# Altium schematic sheet EMG_Sensors_Control.SchDoc
size 431 x 279 mm; SheetNumber: 1; SheetTotal: 1; ENG_APP_DATE: --/--/--; DSN_APP_DATE: --/--/--; CHK_APP_DATE: --/--/--
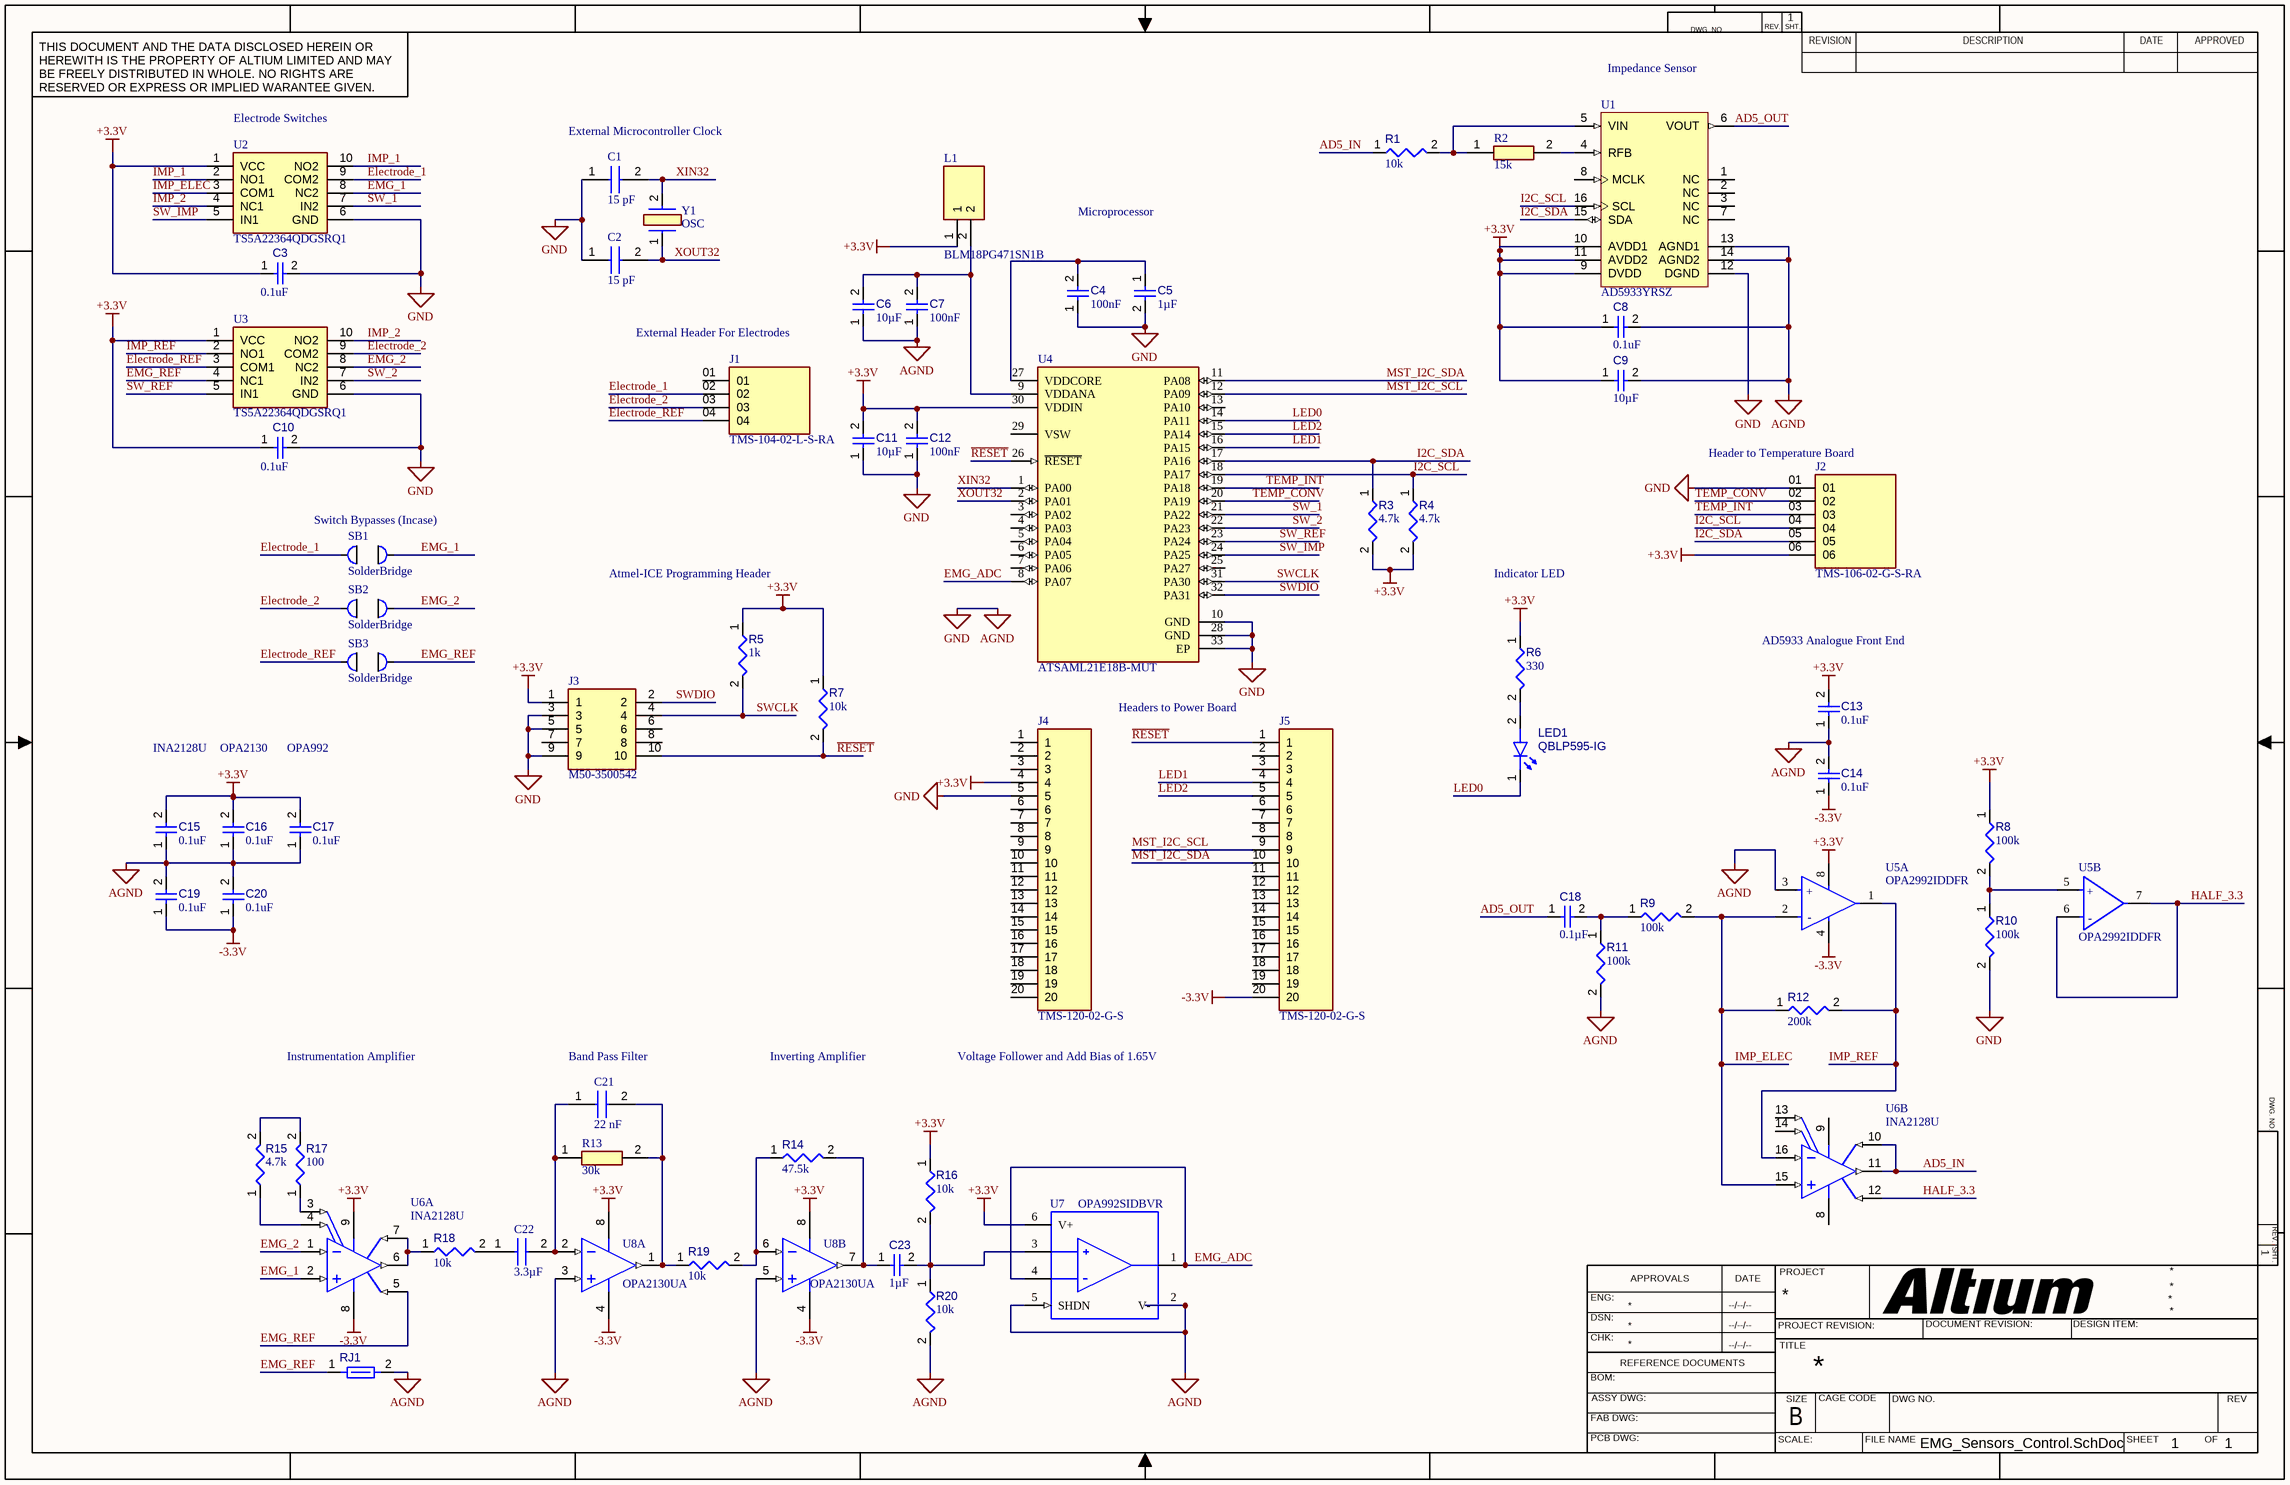
[diagram p0: EMG_Sensors_Control.SchDoc]

## Parts
C1  15 pF  [CAPC1005X55N]
C2  15 pF  [CAPC1005X55N]
C3  value 0.1uF  [CAPC1005X56X25LL10T15]  (hidden comment: Capacitor 0.1 uF +/- 5% 16 V 0402)
C4  value 100nF  [CAPC1005X56X25LL10T15]  (hidden comment: Capacitor 0.1 uF +/- 5% 16 V 0402)
C5  value 1µF  [CAPC1608X90X35ML15T15]  (hidden comment: Capacitor 1uF +/- 10% 16V 0603)
C6  value 10µF  [CAPC2013X135X45NL10T25]  (hidden comment: Capacitor 10 uF +/- 10% 16 V 0805)
C7  value 100nF  [CAPC1005X56X25LL10T15]  (hidden comment: Capacitor 0.1 uF +/- 5% 16 V 0402)
C8  value 0.1uF  [CAPC1005X56X25LL10T15]  (hidden comment: Capacitor 0.1 uF +/- 5% 16 V 0402)
C9  value 10µF  [CAPC0603(1608)100_L]  (hidden comment: Capacitor 10µF +/-20% 10V 0603)
C10  value 0.1uF  [CAPC1005X56X25LL10T15]  (hidden comment: Capacitor 0.1 uF +/- 5% 16 V 0402)
C11  value 10µF  [CAPC2013X135X45NL10T25]  (hidden comment: Capacitor 10 uF +/- 10% 16 V 0805)
C12  value 100nF  [CAPC1005X56X25LL10T15]  (hidden comment: Capacitor 0.1 uF +/- 5% 16 V 0402)
C13  value 0.1uF  [CAPC1005X56X25LL10T15]  (hidden comment: Capacitor 0.1 uF +/- 5% 16 V 0402)
C14  value 0.1uF  [CAPC1005X56X25LL10T15]  (hidden comment: Capacitor 0.1 uF +/- 5% 16 V 0402)
C15  value 0.1uF  [CAPC1005X56X25LL10T15]  (hidden comment: Capacitor 0.1 uF +/- 5% 16 V 0402)
C16  value 0.1uF  [CAPC1005X56X25LL10T15]  (hidden comment: Capacitor 0.1 uF +/- 5% 16 V 0402)
C17  value 0.1uF  [CAPC1005X56X25LL10T15]  (hidden comment: Capacitor 0.1 uF +/- 5% 16 V 0402)
C18  value 0.1µF  [CAPC1005X55X25LL05T10]  (hidden comment: Capacitor 1 uF +/- 10% 6.3 V 0402)
C19  value 0.1uF  [CAPC1005X56X25LL10T15]  (hidden comment: Capacitor 0.1 uF +/- 5% 16 V 0402)
C20  value 0.1uF  [CAPC1005X56X25LL10T15]  (hidden comment: Capacitor 0.1 uF +/- 5% 16 V 0402)
C21  22 nF  [CAPC1005X55N]
C22  3.3µF  [C1005_Commercial]
C23  value 1µF  [CAPC1005X55X25LL05T10]  (hidden comment: Capacitor 1 uF +/- 10% 6.3 V 0402)
J1  TMS-104-02-L-S-RA  [SAMTEC_TMS-104-02-L-S-RA]
J2  TMS-106-02-G-S-RA  [SAMTEC_TMS-106-02-G-S-RA]
J3  M50-3500542  [M503500542]
J4  TMS-120-02-G-S  [TMS-120-YY-XX-S]
J5  TMS-120-02-G-S  [TMS-120-YY-XX-S]
L1  BLM18PG471SN1B  [BLM18AG102BH1D]
LED1  QBLP595-IG  [QTB-QBLP595_V]
R1  value 10k  [RESC1005X40X25ML05T05]  (hidden comment: Resistor 10k +/-1% 0402 63 mW)
R2  15k  [H2C/H2R]
R3  value 4.7k  [RESC1005X40X25ML05T05]  (hidden comment: Resistor 4k7 +/-1% 0402 100 mW)
R4  value 4.7k  [RESC1005X40X25ML05T05]  (hidden comment: Resistor 4k7 +/-1% 0402 100 mW)
R5  value 1k  [RESC1005X40X25ML05T05]  (hidden comment: Resistor 1k +/-1% 0402 63 mW)
R6  value 330  [RESC0402(1005)_L]  (hidden comment: Resistor 330R +/-5 % 0402 63 mW)
R7  value 10k  [RESC1005X40X25ML05T05]  (hidden comment: Resistor 10k +/-1% 0402 63 mW)
R8  value 100k  [RESC1005X40X25ML05T05]  (hidden comment: Resistor 100k +/-1% 0402 63 mW)
R9  value 100k  [RESC1005X40X25ML05T05]  (hidden comment: Resistor 100k +/-1% 0402 63 mW)
R10  value 100k  [RESC1005X40X25ML05T05]  (hidden comment: Resistor 100k +/-1% 0402 63 mW)
R11  value 100k  [RESC1005X40X25ML05T05]  (hidden comment: Resistor 1k +/-1% 0402 63 mW)
R12  value 200k  [RESC0402(1005)_L]  (hidden comment: Resistor 1M +/-1 % 0402 63 mW)
R13  30k  [RESC1005X40N]
R14  value 47.5k  [RESC0402(1005)_L]  (hidden comment: Resistor 47K5 +/-1 % 0402 63 mW)
R15  value 4.7k  [RESC1005X40X25ML05T05]  (hidden comment: Resistor 4k7 +/-1% 0402 100 mW)
R16  value 10k  [RESC1005X40X25ML05T05]  (hidden comment: Resistor 10k +/-1% 0402 63 mW)
R17  value 100  [RESC0402(1005)_L]  (hidden comment: 100R2F)
R18  value 10k  [RESC1005X40X25ML05T05]  (hidden comment: Resistor 10k +/-1% 0402 63 mW)
R19  value 10k  [RESC1005X40X25ML05T05]  (hidden comment: Resistor 10k +/-1% 0402 63 mW)
R20  value 10k  [RESC1005X40X25ML05T05]  (hidden comment: Resistor 10k +/-1% 0402 63 mW)
RJ1  Net Tie 10x8mil  [New footprint 1]  (value not drawn)  (net tie, no BOM)
SB1  SolderBridge  [SolderBridge-Footprint-1]
SB2  SolderBridge  [SolderBridge-Footprint-1]
SB3  SolderBridge  [SolderBridge-Footprint-1]
U1  AD5933YRSZ  [ADI-RS-16_L]
U2  TS5A22364QDGSRQ1  [SOP50P490X110-10N]
U3  TS5A22364QDGSRQ1  [SOP50P490X110-10N]
U4  ATSAML21E18B-MUT  [FP-PG-IPC_B]
U5  OPA2992IDDFR  [FP-DDF0008A-MFG]  (parts A,B of 2)
U6  INA2128U  [DW0016A_N]  (parts A,B of 2)
U7  OPA992SIDBVR  [FP-DBV0006A-MFG]
U8  OPA2130UA  [D0008A_N]  (parts A,B of 2)
Y1  OSC  [ABS0716632768KHZT]

## Nets
+3.3V: C3.1 C8.1 C9.1 C10.1 C11.2 C12.2 C13.2 C15.2 C16.2 C17.2 J2.06 J3.1 J4.4 L1.1 R3.2 R4.2 R5.1 R6.1 R7.1 R8.1 R16.1 U1.9(DVDD) U1.10(AVDD1) U1.11(AVDD2) U2.1(VCC) U3.1(VCC) U4.30(VDDIN) U5.8(V+) U6.9(V+) U7.6(V+) U8.8(V+)
-3.3V: C14.1 C19.1 C20.1 J5.20 U5.4(V-) U6.8(V-) U8.4(V-)
AGND: C1.1 C2.1 C3.2 C4.1 C5.2 C6.1 C7.1 C8.2 C9.2 C10.2 C11.1 C12.1 C13.1 C14.2 C15.1 C16.1 C17.1 C19.2 C20.2 J2.01 J3.3 J3.5 J3.9 J4.5 R10.2 R11.2 R20.2 RJ1.2 U1.12(DGND) U1.13(AGND1) U1.14(AGND2) U2.6(GND) U3.6(GND) U4.10(GND) U4.28(GND) U4.33(EP) U5.3(IN1+) U7.2(V-) U7.5(SHDN) U8.3(IN_A+) U8.5(IN_B+)  [also labelled GND]
~{RESET}: J3.10 J5.1 R7.2 U4.26(~{RESET})
AD5_IN: R1.1 U6.10(SENSEB) U6.11(VOB)
AD5_OUT: C18.1 U1.6(VOUT)
Electrode_1: J1.02 SB1.2 U2.9(COM2)
Electrode_2: J1.03 SB2.2 U3.9(COM2)
Electrode_REF: J1.04 SB3.2 U3.3(COM1)
EMG_1: SB1.1 U2.8(NC2) U6.2(VINA+)
EMG_2: SB2.1 U3.8(NC2) U6.1(VINA-)
EMG_ADC: U4.8(PA07) U7.1(OUT) U7.4(-IN)
EMG_REF: RJ1.1 SB3.1 U3.4(NC1) U6.5(REFA)
HALF_3.3: U5.6(IN2-) U5.7(OUT2) U6.12(REFB)
I2C_SCL: J2.04 R4.1 U1.16(SCL) U4.18(PA17)
I2C_SDA: J2.05 R3.1 U1.15(SDA) U4.17(PA16)
IMP_1: U2.2(NO1) U2.10(NO2)
IMP_2: U2.4(NC1) U3.10(NO2)
IMP_ELEC: R9.2 R12.1 U2.3(COM1) U5.2(IN1-) U6.15(VINB+)
IMP_REF: R12.2 U3.2(NO1) U5.1(OUT1) U6.16(VINB-)
LED0: LED1.1(K) U4.14(PA11)
LED1: J5.4 U4.16(PA15)
LED2: J5.5 U4.15(PA14)
MST_I2C_SCL: J5.9 U4.12(PA09)
MST_I2C_SDA: J5.10 U4.11(PA08)
SW_1: U2.7(IN2) U4.21(PA22)
SW_2: U3.7(IN2) U4.22(PA23)
SW_IMP: U2.5(IN1) U4.24(PA25)
SW_REF: U3.5(IN1) U4.23(PA24)
SWCLK: J3.4 R5.2 U4.31(PA30)
SWDIO: J3.2 U4.32(PA31)
TEMP_CONV: J2.02 U4.20(PA19)
TEMP_INT: J2.03 U4.19(PA18)
XIN32: C1.2 U4.1(PA00) Y1.2
XOUT32: C2.2 U4.2(PA01) Y1.1
NetC4_2: C4.2 C5.1 U4.27(VDDCORE)
NetC6_2: C6.2 C7.2 L1.2 U4.9(VDDANA)
NetC18_2: C18.2 R9.1 R11.1
NetC21_1: C21.1 C22.2 R13.1 U8.2(IN_A-)
NetC21_2: C21.2 R13.2 R19.1 U8.1(OUT_A)
NetC22_1: C22.1 R18.2
NetC23_1: C23.1 R14.2 U8.7(OUT_B)
NetC23_2: C23.2 R16.2 R20.1 U7.3(+IN)
NetLED1_2: LED1.2(A) R6.2
NetR1_2: R1.2 R2.1 U1.5(VIN)
NetR2_2: R2.2 U1.4(RFB)
NetR8_2: R8.2 R10.1 U5.5(IN2+)
NetR14_1: R14.1 R19.2 U8.6(IN_B-)
NetR15_1: R15.1 U6.4(RGA)
NetR15_2: R15.2 R17.2
NetR17_1: R17.1 U6.3(RGA)
NetR18_1: R18.1 U6.6(VOA) U6.7(SENSEA)

Not connected (* = marked no-connect by the designer): J1 01; J3 6 7 8; J4 1 2 3 6 7 8 9 10 11 12 13 14 15 16 17 18 19 20; J5 2 3 6 7 8 11 12 13 14 15 16 17 18 19; U1 1(NC) 2(NC) 3(NC) 7(NC) 8(MCLK); U4 3(PA02) 4(PA03) 5(PA04) 6(PA05) 7(PA06) 13(PA10) 25(PA27) 29(VSW); U6 13(RGB) 14(RGB)

## Notes on the sheet
- (near U1) Impedance Sensor
- (near U2) Electrode Switches
- (near C1) External Microcontroller Clock
- Microprocessor
- External Header For Electrodes
- (near J2) Header to Temperature Board
- (near SB1) Switch Bypasses (Incase)
- Atmel-ICE Programming Header
- Indicator LED
- AD5933 Analogue Front End
- INA2128U
- OPA2130
- OPA992
- Headers to Power Board
- Instrumentation Amplifier
- (near C21) Band Pass Filter
- Inverting Amplifier
- Voltage Follower and Add Bias of 1.65V
- DWG. NO.
- REV.
- SHT.
- THIS DOCUMENT AND THE DATA DISCLOSED HEREIN OR HEREWITH IS THE PROPERTY OF ALTIUM LIMITED AND MAY BE FREELY DISTRIBUTED IN WHOLE. NO RIGHTS ARE RESERVED OR EXPRESS OR IMPLIED WARANTEE GIVEN.
- REVISION
- DESCRIPTION
- DATE
- APPROVED
- ENG:
- APPROVALS
- PROJECT
- DSN:
- CHK:
- REFERENCE DOCUMENTS
- PROJECT REVISION:
- TITLE
- DOCUMENT REVISION:
- DESIGN ITEM:
- BOM:
- FAB DWG:
- PCB DWG:
- ASSY DWG:
- SCALE:
- SIZE
- B
- CAGE CODE
- FILE NAME
- DWG NO.
- SHEET
- OF
- REV
- (in symbol CMP-04895-000462-1, part A) +; -
- (in symbol CMP-04895-000462-1, part B) +; -

## Library data of the parts
C1 C2 = GCM1555C1H150JA16D: Capacitor 15PF 50V 5% 0402GCM1555C1H150JA16D; Manufacturer_Name: Murata Electronics; Datasheet Link: https://psearch.en.murata.com/capacitor/product/GCM1555C1H150JA16%23.html; Height: 0.55mm; Manufacturer_Part_Number: GCM1555C1H150JA16D; Mouser Part Number: 81-GCM1555C1H150JA6D; Mouser Price/Stock: https://www.mouser.co.uk/ProductDetail/Murata-Electronics/GCM1555C1H150JA16D?qs=jDWTHf1mkXYg4D1%252B30O6Eg%3D%3D; Arrow Part Number: GCM1555C1H150JA16D; Arrow Price/Stock: https://www.arrow.com/en/products/gcm1555c1h150ja16d/murata-manufacturing?region=nac
C3 C4 C7 C8 C10 C12-C17 C19 C20 = CMP-001-00001-6: Chip Capacitor, 0.1 uF, +/- 5%, 16 V, 0402 (1005 Metric); Capacitor Type: Ceramic; Voltage Rating: 16V; Max Operating Temperature: 125°C; Min Operating Temperature: -55°C; Case/Package: 0402; Mounting Technology: SM; Pins: 2; Tolerance: 5%; RoHS Compliant: True
C5 = CMP-001-00004-6: Chip Capacitor, 1 uF, +/- 10%, 16 V, 0603 (1608 Metric); Capacitor Type: Ceramic; Mounting Technology: SM; RoHS Compliant: True; Min Operating Temperature: -55°C; Case/Package: 0603; Pins: 2; Voltage Rating: 16V; Max Operating Temperature: 125°C; Tolerance: 10%
C6 C11 = CMP-001-00015-6: Chip Capacitor, 10 uF, +/- 10%, 16 V, 0805 (2012 Metric); Voltage Rating: 16V; Capacitor Type: Ceramic; RoHS Compliant: True; Max Operating Temperature: 85°C; Min Operating Temperature: -55°C; Mounting Technology: SM; Tolerance: 10%; Case/Package: 0805; Pins: 2
C9 = CMP-001-00075-4: Chip Capacitor, 10µF +/-20%, 10V, 0603, Thickness 1 mm; Tolerance: 10%; Voltage Rating: 10V; Max Operating Temperature: 85°C; Pins: 2; Case/Package: 0603; Mounting Technology: SMT; Min Operating Temperature: -55°C
C18 C23 = CMP-001-00008-6: Chip Capacitor, 1 uF, +/- 10%, 6.3 V, 0402 (1005 Metric); Capacitor Type: Ceramic; Voltage Rating: 6.3V; Max Operating Temperature: 85°C; Mounting Technology: SM; Tolerance: 10%; Case/Package: 0402; RoHS Compliant: True; Min Operating Temperature: -55°C; Pins: 2
C21 = GRM155R70J222KA01D: Capacitor 22nF; Manufacturer_Name: Murata Electronics; Datasheet Link: https://datasheet.datasheetarchive.com/originals/distributors/Datasheets_SAMA/ec4f1577dddcc7a13ddad897a28002d3.pdf; Height: 0.55mm; Manufacturer_Part_Number: GRM155R70J222KA01D; Mouser Part Number: 81-GRM155R70J222KA1D; Mouser Price/Stock: https://www.mouser.co.uk/ProductDetail/Murata-Electronics/GRM155R70J222KA01D?qs=y02iAgv9n62BiqXMhBx0hg%3D%3D; Arrow Part Number: GRM155R70J222KA01D; Arrow Price/Stock: https://www.arrow.com/en/products/grm155r70j222ka01d/murata-manufacturing
C22 = C1005X5R0J335K050BC: Capacitor 3.3uF C1005X5R0J335K050BC; Manufacturer_Name: TDK; Datasheet Link: https://product.tdk.com/system/files/dam/doc/product/capacitor/ceramic/mlcc/catalog/mlcc_commercial_general_en.pdf; Height: 0.55mm; Manufacturer_Part_Number: C1005X5R0J335K050BC; Mouser Part Number: 810-C1005X5R0J335K; Mouser Price/Stock: https://www.mouser.co.uk/ProductDetail/TDK/C1005X5R0J335K050BC?qs=dfay7wIA1uECT7biEkI9Ng%3D%3D; Arrow Part Number: C1005X5R0J335K050BC; Arrow Price/Stock: https://www.arrow.com/en/products/c1005x5r0j335k050bc/tdk
J3 = M50-3500542: Connector M50-3500542; Manufacturer_Name: Harwin; Datasheet Link: https://datasheet.datasheetarchive.com/originals/distributors/SFDatasheet-1/sf-00022684.pdf; Height: 4.15mm; Manufacturer_Part_Number: M50-3500542; Mouser Part Number: 855-M50-3500542; Mouser Price/Stock: https://www.mouser.co.uk/ProductDetail/Harwin/M50-3500542?qs=9fQaSFfsqsyXI0P9tFOVoQ%3D%3D
J4 J5 = TMS-120-02-G-S: Connector - male needed, place on top board TMS-120-02-G-S; Manufacturer_Name: SAMTEC; Datasheet Link: http://suddendocs.samtec.com/prints/tms-1xx-xx-xx-x-xx-xxx-mkt.pdf; Manufacturer_Part_Number: TMS-120-02-G-S; Mouser Part Number: 200-TMS12002GS; Mouser Price/Stock: https://www.mouser.co.uk/ProductDetail/Samtec/TMS-120-02-G-S?qs=0lQeLiL1qyZLykZTiH0Mag%3D%3D
L1 = BLM18PG471SN1B: Filter BLM18PG471SN1B; Manufacturer_Name: Murata Electronics; Datasheet Link: https://www.murata.com/en-us/products/productdetail?partno=BLM18PG471SN1%23; Height: 0.95mm; Manufacturer_Part_Number: BLM18PG471SN1B; Mouser Part Number: 81-BLM18PG471SN1B; Mouser Price/Stock: https://www.mouser.com/Search/Refine.aspx?Keyword=81-BLM18PG471SN1B
LED1 = CMP-007-00041-3: Chip LED 0402, Green, 0.02 A, 3.1 to 3.7 V, -40 to 80 degC, 2-Pin SMD, RoHS, Tape and Reel  QBLP595-IG; Case/Package: 0402; Colour: Green; Mounting Technology: SMT; Pins: 2; RoHS Compliant: Yes
R1 R7 R16 R18-R20 = CMP-009-00019-5: Chip Resistor, 10 KOhm, +/- 1%, 63 mW, -55 to 155 degC, 0402 (1005 Metric); Power: 63mW; Voltage Rating: 50V; Case/Package: 0402; Mounting Technology: SM; Pins: 2; Min Operating Temperature: -55°C; Tolerance: 1%; RoHS Compliant: True; Max Operating Temperature: 155°C
R2 = ERJ-H2RD1502X: Resistor  ERJ-H2RD1502X; Manufacturer_Name: Panasonic; Datasheet Link: http://industrial.panasonic.com/cdbs/www-data/pdf/RDQ0000/ast-ind-151033.pdf; Manufacturer_Part_Number: ERJ-H2RD1502X
R3 R4 R15 = CMP-009-00030-5: Chip Resistor, 4.7 KOhm, +/- 1%, 0.1 W, -55 to 155 degC, 0402 (1005 Metric); Power: 100mW; Voltage Rating: 50V; Mounting Technology: SM; RoHS Compliant: True; Tolerance: 1%; Min Operating Temperature: -55°C; Max Operating Temperature: 155°C; Case/Package: 0402; Pins: 2
R5 R11 = CMP-009-00012-5: Chip Resistor, 1 KOhm, +/- 1%, 63 mW, -55 to 155 degC, 0402 (1005 Metric); Power: 63mW; Max Operating Temperature: 155°C; Min Operating Temperature: -55°C; Case/Package: 0402; Pins: 2; RoHS Compliant: True; Tolerance: 1%; Mounting Technology: SM
R6 = CMP-009-00132-3: Chip Resistor, 330 Ohms, +/-5 %, 63 mW, -55 to 155 degC, 0402; Power: 63mW; Tolerance: 5%; Pins: 2; Max Operating Temperature: 155°C; Min Operating Temperature: -55°C; Case/Package: 0402
R8-R10 = CMP-009-00021-5: Chip Resistor, 100 KOhm, +/- 1%, 0.063 W, -55 to 155 degC, 0402 (1005 Metric); Voltage Rating: 50V; Power: 63mW; Pins: 2; Tolerance: 1%; Max Operating Temperature: 155°C; Case/Package: 0402; Min Operating Temperature: -55°C; Mounting Technology: SM; RoHS Compliant: True
R12 = CMP-009-00165-3: Chip Resistor, 1 MOhms, +/-1 %, 63 mW, -55 to 155 degC, 0402; Tolerance: 1%; Power: 63mW; Case/Package: 0402; Pins: 2
R13 = SFR01MZPJ303: Resistor 30k 0402 SFR01MZPJ303; Manufacturer_Name: ROHM Semiconductor; Datasheet Link: https://www.mouser.co.uk/datasheet/2/348/sfr_e-3009639.pdf; Height: 0.4mm; Manufacturer_Part_Number: SFR01MZPJ303
R14 = CMP-009-00137-3: Chip Resistor, 47,5 kOhms, +/-1 %, 63 mW, -55 to 155 degC, 0402; Power: 63mW; Tolerance: 1%; Pins: 2; Case/Package: 0402; Min Operating Temperature: -55°C; Max Operating Temperature: 155°C
R17 = CMP-009-00065-2: 100R 0.063W 1% 0402 (1005 Metric)  SMD; Power: 63mW; Tolerance: 1%; Case/Package: 0402; Pins: 2; Mounting Technology: SMT
RJ1 = CMP-009-00116-2: Min Operating Temperature: -55°C; Pins: 2; Max Operating Temperature: 155°C
SB1-SB3 = CMP-00000-1: Simple open solder bridge
U1 = CMP-0293-00046-1: 1 MSPS, 12-Bit Impedance Converter, Network Analyzer, Serial, RS-16, 77 Tube, Pb-Free; Tuning Word Width (bits): 27bit; I Supply total (max): 15mA; Master fclk: 16.776MHz; Resolution (Bits): 12bit; PackageVersion: 3/17/2005; I/O Interface: Serial; ComponentLink2URL: http://www.analog.com/static/imported-files/data_sheets/AD5933.pdf; PackageReference: RS-16; ComponentLink2Description: Datasheet; ComponentLink1URL: www.analog.com; Code_JEDEC: MO-150-AC; PackageDescription: 16-Lead Shrink Small Outline Package [SSOP]; ComponentLink1Description: Manufacturer URL; ComponentLink3URL: http://www.analog.com/static/imported-files/packages/31572257652246RS_16.pdf; ComponentLink3Description: Package Specification; DatasheetVersion: Rev. D
U2 U3 = TS5A22364QDGSRQ1: Integrated Circuit; Manufacturer_Name: Texas Instruments; Datasheet Link: http://www.ti.com/lit/gpn/ts5a22364-q1; Height: 1.1mm; Manufacturer_Part_Number: TS5A22364QDGSRQ1; Mouser Part Number: 595-TS5A22364QDGSRQ1; Mouser Price/Stock: https://www.mouser.co.uk/ProductDetail/Texas-Instruments/TS5A22364QDGSRQ1?qs=1CfNGUMoiQ80LHbRl6nZYw%3D%3D; Arrow Part Number: TS5A22364QDGSRQ1; Arrow Price/Stock: https://www.arrow.com/en/products/ts5a22364qdgsrq1/texas-instruments?region=nac
U4 = CMP-06276-000180-1: IC MCU 32BIT 256KB FLASH 32QFN; Peripherals: POR; Core Architecture: ARM; Frequency: 48MHz; Oscillator Type: Internal; Number of I/Os: 25; Interface: I2C; Min Operating Temperature: -40°C; Memory Type: FLASH; Memory Size: 256KB; Max Operating Temperature: 85°C; Case/Package: QFN; RoHS Compliant: Yes; Packaging: Cut Tape
U5 = CMP-04895-000462-1: IC OPAMP GP 2 CIRCUIT TSOT23-8
U6 = CMP-0985-00122-2: Dual, Low Power Instrumentation Amplifier, -40 to 85 degC, 16-pin SOIC (DW16), Green (RoHS & no Sb/Br); Manufacturer: Texas Instruments; Number of Channels: 2; Vs(Min)(V): 4.5; Vs(Max)(V): 36; SubFamily: Difference Amplifier; Dual Supply: TRUE; Gain(V/V): 1 to 10000; Input Offset (+/-)(Max)(uV): 50; CMRR(Min)(dB): 120; Slew Rate(Typ)(V/us): 4; Mounting Technology: Surface Mount; ComponentLink1URL: http://www.ti.com/; Code_JEDEC: MS-013; PackageVersion: 4040000-2/G, 01/2011; DatasheetVersion: SBOS035A; ComponentLink2Description: Datasheet; ComponentLink3URL: http://www.ti.com/litv/pdf/msoi003g; ComponentLink1Description: Manufacturer URL; Eco-Plan: Green (RoHS & no Sb/Br); ComponentLink3Description: Package Specification; PartNumber: INA2128U; PackageReference: DW0016A; PackageDescription: 16-Pin Plastic Small Outline, Body 10.30 x 7.50 mm, Pitch 1.27 mm; ComponentLink2URL: http://www.ti.com/general/docs/lit/getliterature.tsp?genericPartNumber=INA2128&fileType=pdf
U7 = CMP-04895-000474-1: IC OPAMP
U8 = CMP-0271-00118-3: Low Power, Precision FET-Input Operational Amplifier, 4.5 to 36 V, -40 to 85 degC, 8-pin SOIC (D8), Green (RoHS & no Sb/Br); Manufacturer: Texas Instruments; GBW(Typ)(MHz): 1; Iq per channel(Max)(mA): 0.65; Offset Drift(Typ)(uV/C): 2; Packing: TUBE; Rating: Catalog; Sub Family: High Supply Voltage Amplifier (>=30V), Precision Amplifier; Total Supply Voltage(Max)(+5V is 5, +/-5V is 10): 36; Total Supply Voltage(Min)(+5V is 5, +/-5V is 10): 4.5; IIB(Max)(pA): 20; CMRR(Min)(dB): 90; Vio (25C)(Max)(mV): 1; ComponentLink1URL: http://www.ti.com/; PartNumber: OPA2130UA; DatasheetVersion: SBOS053A; ComponentLink3Description: Package Specification; ComponentLink1Description: Manufacturer URL; Slew Rate(Typ)(V/us): 2; ComponentLink2Description: Datasheet; Number of Channels: 2; PackageDescription: 8-Pin Plastic Small Outline, Body 4.9 x 3.9 mm, Pitch 1.27 mm; Code_JEDEC: MS-012; Eco-Plan: Green (RoHS & no Sb/Br); Mounting Technology: Surface Mount; ComponentLink3URL: http://www.ti.com/litv/pdf/msoi002j; ComponentLink2URL: http://www.ti.com/lit/ds/symlink/opa2130.pdf; PackageReference: D0008A; PackageVersion: 4040047-3/M, 06/2011
Y1 = ABS07-32.768KHZ-T: Crystal or Oscillator ABS07-32.768KHZ-T 12.5pF; Manufacturer_Name: ABRACON; Datasheet Link: https://abracon.com/Resonators/ABS07.pdf; Height: 0.9mm; Manufacturer_Part_Number: ABS07-32.768KHZ-T; Mouser Part Number: 815-ABS07-32.768KHZT; Mouser Price/Stock: https://www.mouser.co.uk/ProductDetail/ABRACON/ABS07-32.768KHZ-T?qs=3SpAxaLJ01g8GJWeO3sA3Q%3D%3D; Arrow Part Number: ABS07-32.768KHZ-T; Arrow Price/Stock: https://www.arrow.com/en/products/abs07-32.768khz-t/abracon?region=europe
J1 = TMS-104-02-L-S-RA: Availability: Unavailable; MP: TMS-104-02-L-S-RA; Price: None; Value: *; Package: None
J2 = TMS-106-02-G-S-RA: Package: None; Price: None; Value: *; MP: TMS-106-02-G-S-RA; Availability: Unavailable